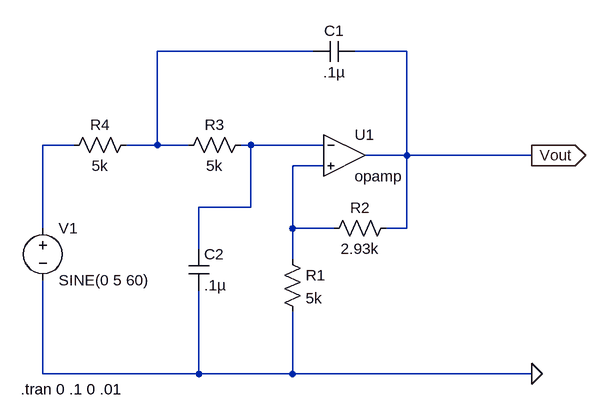
[diagram p0: schematic Draft6.asc]
Draft6.asc, the LTspice schematic file:
Version 4
SHEET 1 880 680
WIRE 128 0 -112 0
WIRE 272 0 192 0
WIRE -240 144 -288 144
WIRE -112 144 -112 0
WIRE -112 144 -160 144
WIRE -64 144 -112 144
WIRE 32 144 16 144
WIRE 144 144 32 144
WIRE 272 160 272 0
WIRE 272 160 208 160
WIRE 464 160 272 160
WIRE 144 176 96 176
WIRE 32 240 32 144
WIRE 32 240 -48 240
WIRE -288 272 -288 144
WIRE 96 272 96 176
WIRE 160 272 96 272
WIRE 272 272 272 160
WIRE 272 272 240 272
WIRE -48 304 -48 240
WIRE 96 320 96 272
WIRE -288 496 -288 352
WIRE -48 496 -48 368
WIRE -48 496 -288 496
WIRE 96 496 96 400
WIRE 96 496 -48 496
WIRE 464 496 96 496
FLAG 464 160 Vout
IOPIN 464 160 Out
FLAG 464 496 0
SYMBOL Opamps\\opamp 176 96 R0
SYMATTR InstName U1
SYMBOL res 80 304 R0
SYMATTR InstName R1
SYMATTR Value 5k
SYMBOL res 256 256 R90
WINDOW 0 0 56 VBottom 2
WINDOW 3 32 56 VTop 2
SYMATTR InstName R2
SYMATTR Value 2.93k
SYMBOL res 32 128 R90
WINDOW 0 0 56 VBottom 2
WINDOW 3 32 56 VTop 2
SYMATTR InstName R3
SYMATTR Value 5k
SYMBOL res -144 128 R90
WINDOW 0 0 56 VBottom 2
WINDOW 3 32 56 VTop 2
SYMATTR InstName R4
SYMATTR Value 5k
SYMBOL cap 192 -16 R90
WINDOW 0 0 32 VBottom 2
WINDOW 3 32 32 VTop 2
SYMATTR InstName C1
SYMATTR Value .1µ
SYMBOL cap -64 304 R0
SYMATTR InstName C2
SYMATTR Value .1µ
SYMBOL voltage -288 256 R0
WINDOW 123 0 0 Left 2
WINDOW 39 0 0 Left 2
SYMATTR InstName V1
SYMATTR Value SINE(0 5 60)
TEXT -322 520 Left 2 !.tran 0 .1 0 .01

The netlist it stands for:
* Draft6.asc
XU1 N003 N004 Vout opamp Aol=100K GBW=10Meg  ; pins invin noninvin out
R1 N004 0 5k
R2 Vout N004 2.93k
R3 N003 N001 5k
R4 N001 N002 5k
C1 Vout N001 .1µ
C2 N003 0 .1µ
V1 N002 0 SINE(0 5 60)
.tran 0 .1 0 .01
.backanno
.end